# EAGLE design mainboard (EAGLE 5.11)
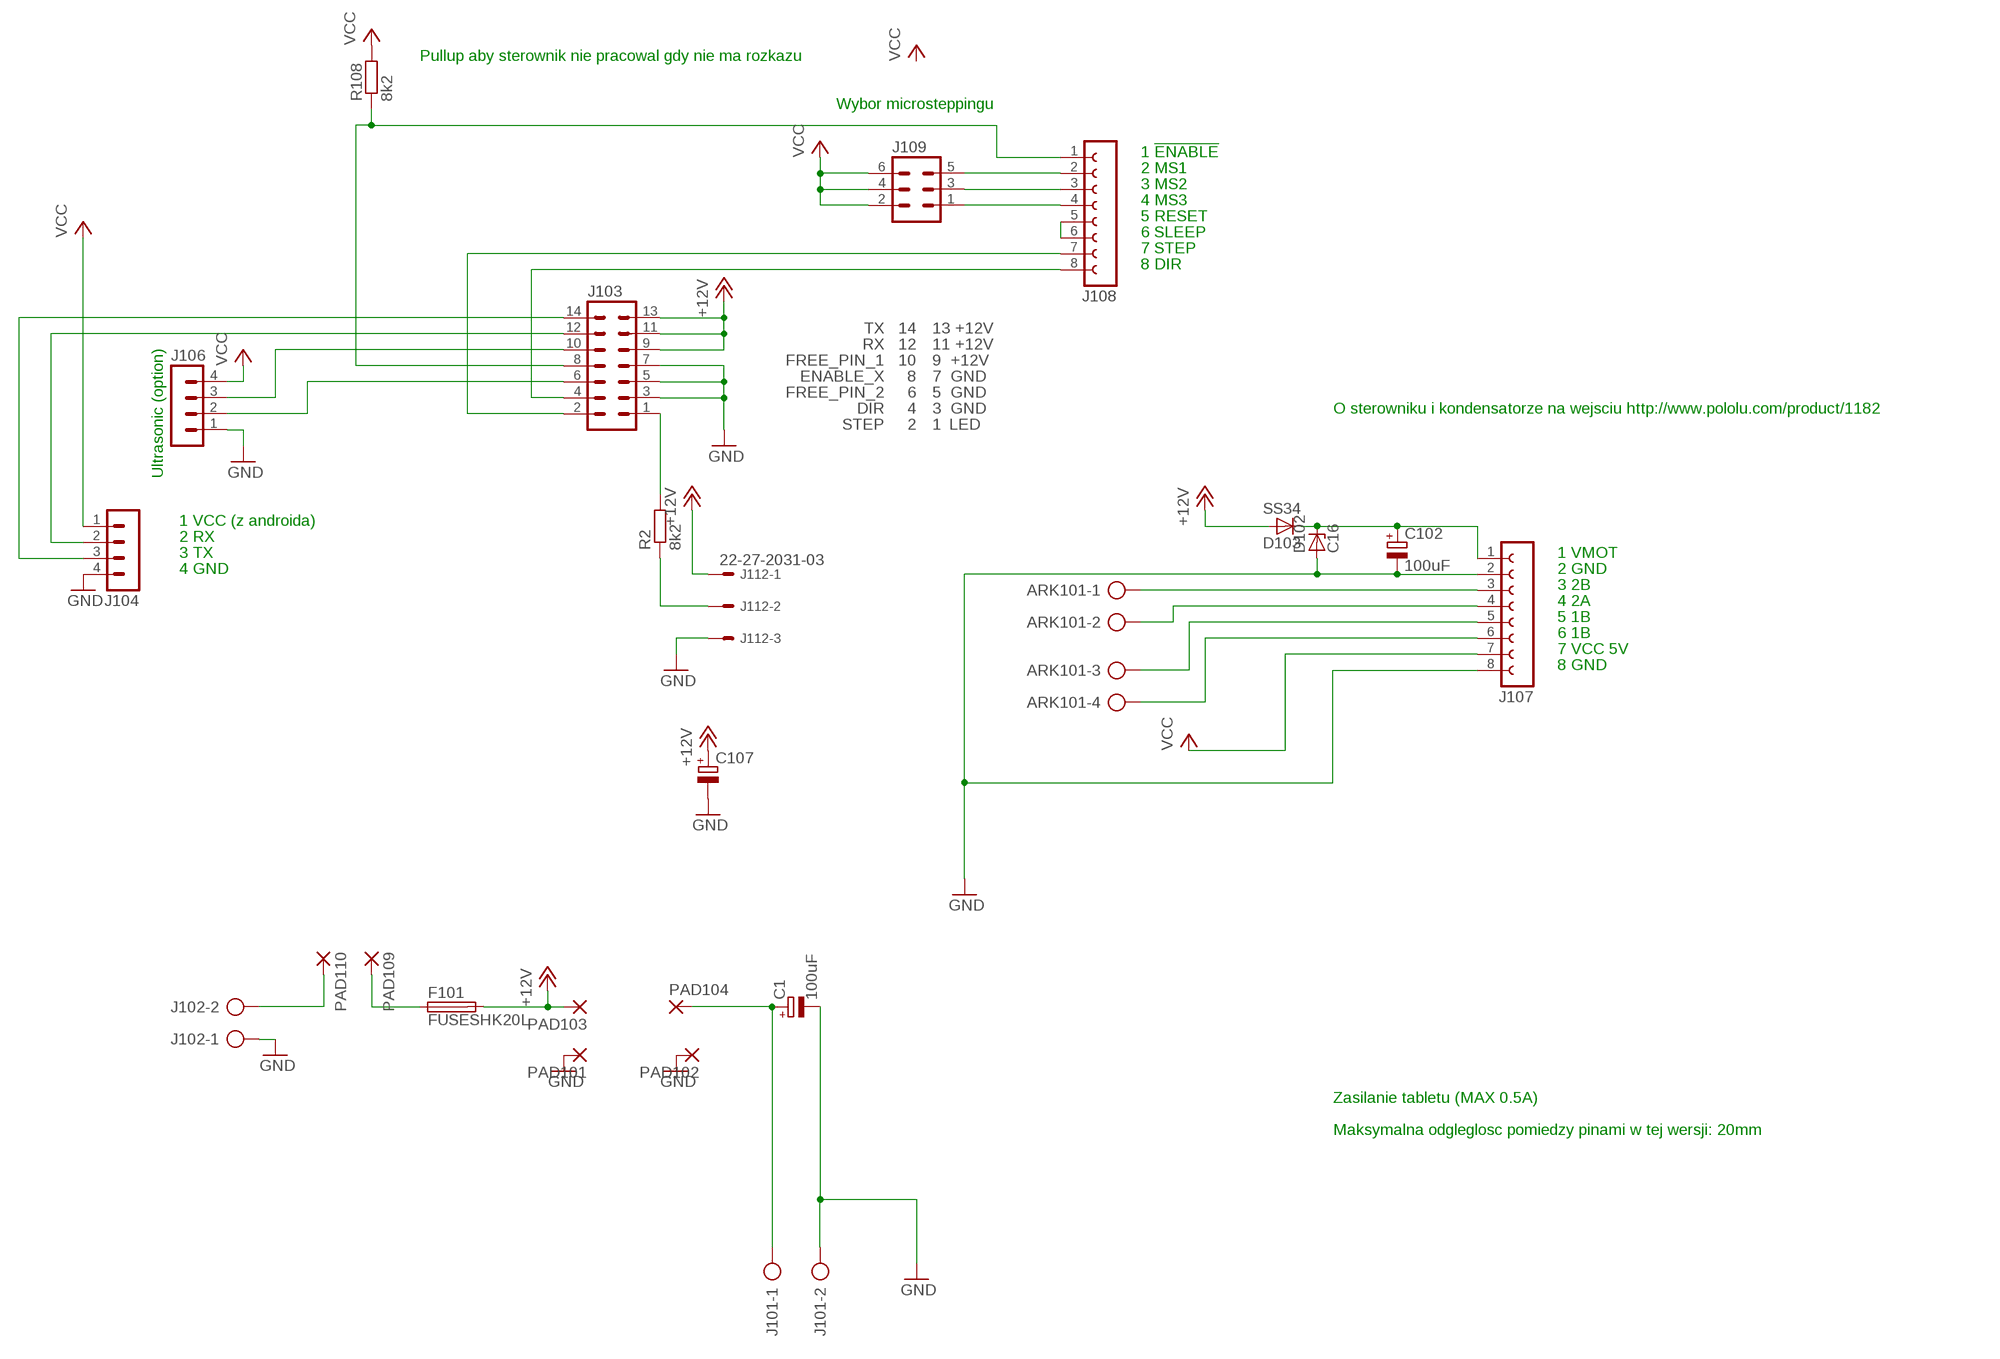
[diagram p0: schematic, sheet 1]

## Parts
ARK101  AK300/4  [AK300/4]
C1  100uF  CPOL-EUE5-10.5  [E5-10,5]
C102  100uF  CPOL-EUE5-10.5  [E5-10,5]
C107  CPOL-EUE5-8.5  [E5-8,5]
D102  C16  ZENER-DIODESOD80C  [SOD80C]
D103  SS34  BYS10  [SOD106A]
F101  FUSESHK20L  [SHK20L]
J101  AK300/2  [AK300/2]
J102  AK300/2  [AK300/2]
J103  ML14  [ML14]
J104  MA04-1  [MA04-1]
J106  MA04-1  [MA04-1]
J107  FE08-1  [FE08]
J108  FE08-1  [FE08]
J109  MA03-2  [MA03-2]
J112  22-27-2031-03  [6410-03]
PAD101  3,17/1,1  [3,17/1,1]
PAD102  3,17/1,1  [3,17/1,1]
PAD103  3,17/1,1  [3,17/1,1]
PAD104  3,17/1,1  [3,17/1,1]
PAD109  3,81/1,3  [3,81/1,3]
PAD110  3,81/1,3  [3,81/1,3]
R2  8k2  RES0805  [0805]
R108  8k2  RES0805  [0805]

## Nets
+12V [VCC12V]: C107.+ D103.A F101.2A J103.9 J103.11 J103.13 J112.1 PAD103.1(P)
GND [Ground]: C1.- C102.- C107.- D102.A J101.2 J102.1 J103.3 J103.5 J103.7 J104.4 J106.1 J107.2 J107.8 J112.3 PAD101.1(P) PAD102.1(P)
JUMPER101: J103.8 J108.1 R108.1
MISO: J103.4 J108.8
N$1: J103.1 R2.2
N$2 [VCC12V]: C1.+ J101.1 PAD104.1(P)
N$3: J103.2 J108.7
N$4: J112.2 R2.1
N$5: J103.10 J106.3
N$6: J103.6 J106.2
N$7 [VCC12V]: J102.2 PAD110.1(P)
N$8 [VCC12V]: F101.1A PAD109.1(P)
N$17: ARK101.1 J107.3
N$18: ARK101.2 J107.4
N$19: ARK101.3 J107.5
N$20: ARK101.4 J107.6
N$24: J108.5 J108.6
N$35: J108.2 J109.5
N$39: J108.3 J109.3
N$40: J108.4 J109.1
N$43 [VCC12V]: C102.+ D102.C D103.K J107.1
SCL: J103.12 J104.2
SDA: J103.14 J104.3
VCC: J104.1 J106.4 J107.7 J109.2 J109.4 J109.6 R108.2

## Notes on the sheet
- Pullup aby sterownik nie pracowal gdy nie ma rozkazu
- Wybor microsteppingu
- 1 !ENABLE
- 2 MS1
- 3 MS2
- 4 MS3
- 5 RESET
- 6 SLEEP
- 7 STEP
- 8 DIR
- TX | 14 | 13 +12V
- RX | 12 | 11 +12V
- FREE_PIN_1 | 10 | 9  +12V
- ENABLE_X | 8 | 7  GND
- FREE_PIN_2 | 6 | 5  GND
- DIR | 4 | 3  GND | O sterowniku i kondensatorze na wejsciu http://www.pololu.com/product/1182
- STEP | 2 | 1 | LED
- Ultrasonic (option)
- 1 VCC (z androida)
- 2 RX
- 3 TX | 1 VMOT
- 4 GND | 2 GND
- 3 2B
- 4 2A
- 5 1B
- 6 1B
- 7 VCC 5V
- 8 GND
- Zasilanie tabletu (MAX 0.5A)
- Maksymalna odgleglosc pomiedzy pinami w tej wersji: 20mm

## Library data of the parts
ARK101 = con-ptr500:AK300/4: CONNECTOR; OC_FARNELL: unknown; OC_NEWARK: unknown
C1 C102 C107 = rcl:CPOL-EU: POLARIZED CAPACITOR, European symbol
D102 = diode:ZENER-DIODE: Z-Diode
D103 = telefunken:BYS10: DIODE; MPN: BYS10/45; OC_FARNELL: 9549188; OC_NEWARK: 96K7236
F101 = fuse:FUSE: Fuse; OC_FARNELL: unknown; OC_NEWARK: unknown
J101 J102 = con-ptr500:AK300/2: CONNECTOR; OC_FARNELL: unknown; OC_NEWARK: unknown
J103 = con-ml:ML14: HARTING; OC_FARNELL: unknown; OC_NEWARK: unknown
J104 J106 = con-lstb:MA04-1: PIN HEADER; OC_FARNELL: unknown; OC_NEWARK: unknown
J107 J108 = con-lsta:FE08-1: FEMALE HEADER; OC_FARNELL: unknown; OC_NEWARK: unknown
J109 = con-lstb:MA03-2: PIN HEADER; OC_FARNELL: unknown; OC_NEWARK: unknown
J112 = con-molex:22-?-03: CONNECTOR wire to board 2.54 mm (.1 inch) pitch header; OC_FARNELL: unknown; OC_NEWARK: unknown
PAD101-PAD104 = wirepad:3,17/1,1: THROUGH-HOLE PAD
PAD109 PAD110 = wirepad:3,81/1,3: THROUGH-HOLE PAD
R2 R108 = barobot:RES

## Net classes
0 default: width 0.381 mm
1 VCC12V: width 1.778 mm, drill 1.27 mm, clearance 0.508 mm
2 Ground: width 0.508 mm, drill 0.508 mm

## Board
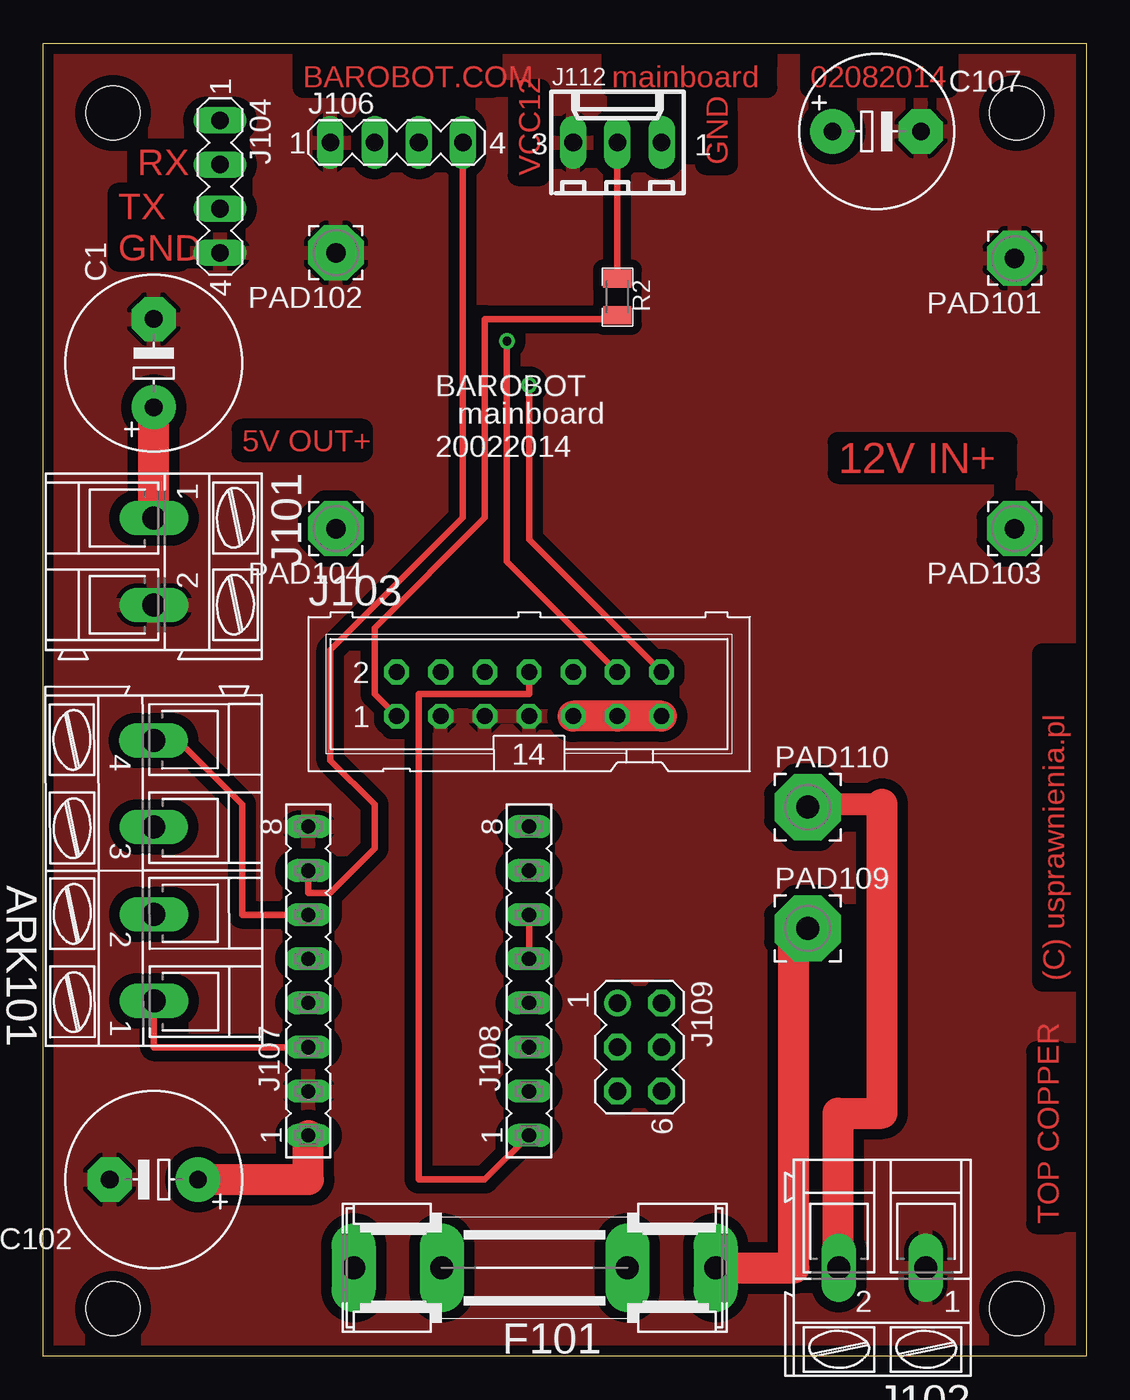
[diagram p1: board, top side]
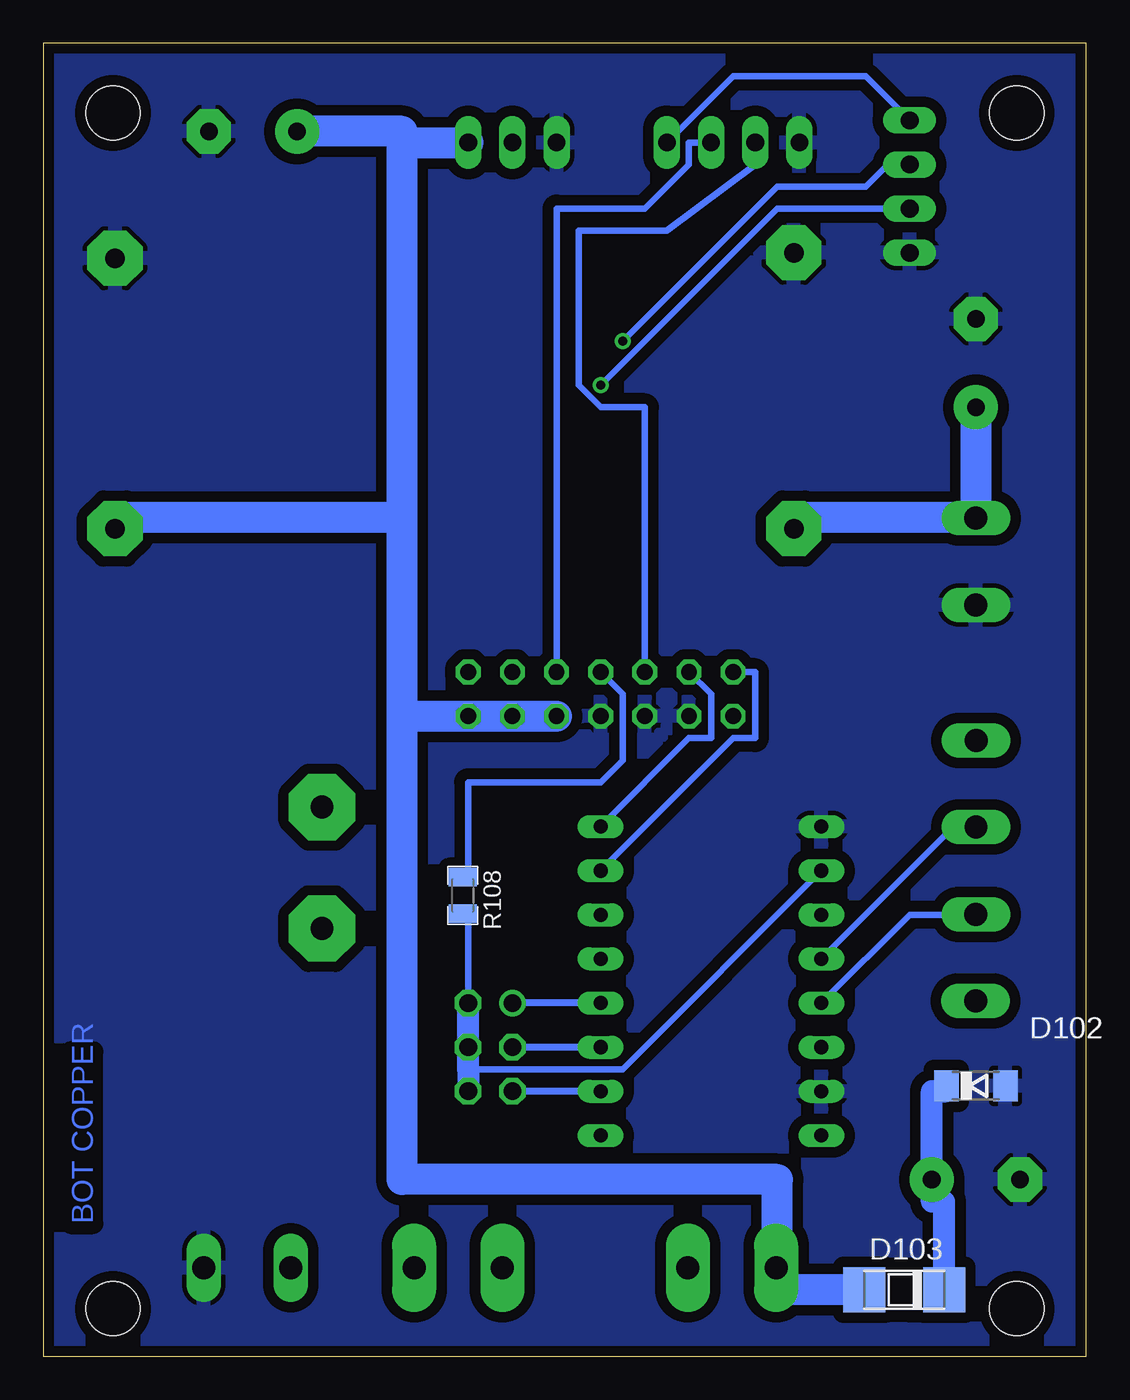
[diagram p2: board, bottom side, seen from below]

Size 60 x 75.55 mm. Coordinates in mm from the lower left corner, seen from the top.
Outline: 0,0 0,75.55 60,75.55 60,0 0,0
Copper layers (1*16): Top 0.035mm / dielectric 1.5mm / Bottom 0.035mm
Design rules "default *": minimum track width 10mil, minimum drill 0.5mm, track to track 8mil, track to pad 8mil, pad to pad 8mil, via to via 8mil, smd to smd 8mil, copper to edge 20mil, drill to drill 8mil, minimum pad ring 10mil, minimum via ring 8mil, stop-mask expansion 4mil, vias tented up to drill 0mil, thermal gap 10mil
Holes 3.1 mm at 4,2.73 56,2.73 56,71.55 4,71.55
bKeepout: area 8.9,67.2 to 11.4,67.6
tRestrict: area 8.9,67.2 to 11.4,67.6
bRestrict: area 10.2,2.5 to 11.4,5.1

### Footprints (pad centres in the part's own frame; a part is rotated, then mirrored left to right if it is on the bottom)
AK300/4 = drill 1.321 long: 1 -7.493,0; 2 -2.515,0; 3 2.515,0; 4 7.493,0
E5-10,5 = drill 1.016 pad 2.54 round: + -2.54,0 | drill 1.016 pad 2.54 octagon: - 2.54,0
E5-8,5 = drill 1.016 pad 2.54 round: + -2.54,0 | drill 1.016 pad 2.54 octagon: - 2.54,0
SOD80C = smd 1.4 x 1.8: A 1.7,0; C -1.7,0
SOD106A = smd 2.4 x 2.6: A 2.3,0; K -2.3,0
SHK20L = drill 1.321 pad 2.54 long: 1A -10.414,0; 1B -5.334,0; 2A 10.414,0; 2B 5.334,0
AK300/2 = drill 1.321 long: 1 -2.515,0; 2 2.489,0
ML14 = drill 0.914 octagon: 1 -7.62,-1.27; 2 -7.62,1.27; 3 -5.08,-1.27; 4 -5.08,1.27; 5 -2.54,-1.27; 6 -2.54,1.27; 7 0,-1.27; 8 0,1.27; 9 2.54,-1.27; 10 2.54,1.27; 11 5.08,-1.27; 12 5.08,1.27; 13 7.62,-1.27; 14 7.62,1.27
MA04-1 = drill 1.016 long: 1 -3.81,0; 2 -1.27,0; 3 1.27,0; 4 3.81,0
FE08 = drill 0.813 long: 1 -8.89,0; 2 -6.35,0; 3 -3.81,0; 4 -1.27,0; 5 1.27,0; 6 3.81,0; 7 6.35,0; 8 8.89,0
MA03-2 = drill 1.016 round: 1 -2.54,-1.27 | drill 1.016 octagon: 2 -2.54,1.27; 3 0,-1.27; 4 0,1.27; 5 2.54,-1.27; 6 2.54,1.27
6410-03 = drill 1.016 long: 1 2.54,0; 2 0,0; 3 -2.54,0
3,17/1,1 = drill 1.118 pad 3.175 octagon: 1 0,0
3,81/1,3 = drill 1.321 pad 3.81 octagon: 1 0,0
0805 = smd 1.044 x 1.6: 1 -1.048,0; 2 1.048,0

### Placement (x,y rotation side)
ARK101  6.35,27.94 90.1 top
C1  6.35,57.15 90 top
C102  6.35,10.16 180 top
C107  47.94,70.48 0 top
D102  6.35,15.56 0 bottom
D103  10.48,3.81 180 bottom
F101  28.26,5.08 180 top
J101  6.35,45.72 270 top
J102  48.26,5.08 180 top
J103  27.94,38.1 0 top
J104  10.16,67.31 270 top
J106  20.32,69.85 0 top
J107  15.24,21.59 90 top
J108  27.94,21.59 90 top
J109  34.29,17.78 270 top
J112  33.02,69.85 0 top
PAD101  55.88,63.18 180 top
PAD102  16.83,63.5 180 top
PAD103  55.88,47.62 180 top
PAD104  16.83,47.62 180 top
PAD109  43.97,24.61 0 top
PAD110  43.97,31.59 0 top
R2  33.02,60.96 270 top
R108  35.88,26.51 270 bottom

### Tracks (layer width: path | path; a pad name or v marks a point on that pad's centre or on a via)
+12V
  Top 1.778: J103.9 J103.11 J103.13
  Bottom 1.27: D103.A 12.7,3.81 | PAD103.1 55.88,46.99 | 17.78,3.81 17.78,5.08
  Bottom 1.778: 39.37,48.26 55.88,48.26 PAD103.1 | 39.37,36.83 39.37,10.16 17.78,10.16 17.78,5.08 F101.2A 17.84,3.81 17.78,3.81 D103.A | 39.37,36.83 J103.13 J103.9 | C107.+ 39.37,70.48 39.37,69.85 | 39.37,48.26 39.37,69.85 | 39.37,36.83 39.37,48.26 | 39.37,69.85 J112.1
GND
  pour Top (isolate 0.61): 0,74.93 59.69,74.93 59.69,0 0,0
  pour Bottom (isolate 0.61): 0,76.2 59.69,76.2 59.69,0 0,0
JUMPER101
  Top 0.381: J108.1 25.4,10.16 21.59,10.16 21.59,38.1 27.94,38.1 J103.8
  Bottom 0.381: J103.8 26.67,38.1 26.67,34.29 27.94,33.02 35.56,33.02 35.56,27.94 R108.1
MISO
  Bottom 0.381: J108.8 22.86,35.56 21.59,35.56 21.59,38.1 J103.4
N$1
  Top 0.381: J103.1 19.05,38.1 19.05,41.91 25.4,48.26 25.4,59.69 33.02,59.69 R2.2
N$2
  Top 1.778: J101.1 C1.+
  Bottom 1.778: C1.+ 6.35,48.26 16.83,48.26 PAD104.1
N$3
  Bottom 0.381: J108.7 20.32,35.56 19.05,35.56 19.05,39.37 J103.2
N$4
  Top 0.381: R2.1 J112.2
N$5
  Bottom 0.381: J103.10 30.48,66.04 25.4,66.04 22.86,68.58 22.86,69.85 J106.3
N$6
  Bottom 0.381: J103.6 25.4,54.61 27.94,54.61 29.21,55.88 29.21,64.77 24.13,64.77 19.05,68.58 J106.2
N$7
  Top 1.27: 48.26,31.75 43.97,31.75 PAD110.1
  Top 1.778: 48.26,31.75 48.26,13.97 45.72,13.97 45.72,5.08 J102.2
N$8
  Top 1.778: F101.1A 43.18,5.08 43.18,24.13 43.97,24.13 PAD109.1
N$17
  Top 0.381: J107.3 6.35,17.78 6.35,20.32 ARK101.1
N$18
  Bottom 0.381: J107.4 10.16,25.4 7.62,25.4 ARK101.2
N$19
  Bottom 0.381: J107.5 7.62,30.48 6.35,30.48 ARK101.3
N$20
  Top 0.381: J107.6 11.43,25.4 11.43,31.75 7.62,35.56 6.35,35.56 ARK101.4
N$24
  Top 0.381: J108.5 J108.6
N$35
  Bottom 0.406: J108.2 J109.5
N$39
  Bottom 0.406: J108.3 J109.3
N$40
  Bottom 0.406: J108.4 J109.1
N$43
  Top 1.778: J107.1 15.24,10.16 C102.+
  Bottom 1.27: D103.K 8.18,8.89 8.89,8.89 C102.+ 8.89,15.24 8.05,15.24 D102.C
SCL  (via drill 0.5)
  Top 0.381: J103.12 26.67,45.72 v26.67,58.42
  Bottom 0.381: v26.67,58.42 17.78,67.31 12.7,67.31 11.43,68.58 J104.2
SDA  (via drill 0.5)
  Top 0.381: J103.14 27.94,46.99 v27.94,55.88
  Bottom 0.381: v27.94,55.88 17.78,66.04 J104.3
VCC
  Top 0.381: J106.4 24.13,48.26 16.51,40.64 16.51,34.29 19.05,31.75 19.05,29.21 16.51,26.67 15.24,26.67 J107.7
  Bottom 0.381: J104.1 12.7,73.66 20.32,73.66 J106.4 | J109.2 35.56,25.4 R108.2 | J107.7 26.67,16.51 35.56,16.51
  Bottom 1.27: J109.2 J109.4 35.56,16.51 J109.6

### Text on the board
Top: BAROBOT.COM | mainboard | 02082014 | GND | RX | VCC12 | TX | GND | 5V OUT+ | 12V IN+ | (C) usprawnienia.pl | TOP COPPER
Bottom: BOT COPPER
tPlace: BAROBOT | mainboard | 20022014